# EAGLE design MOSFET_module_V3A (EAGLE 9.1.2)

## Sheet 1 of 2
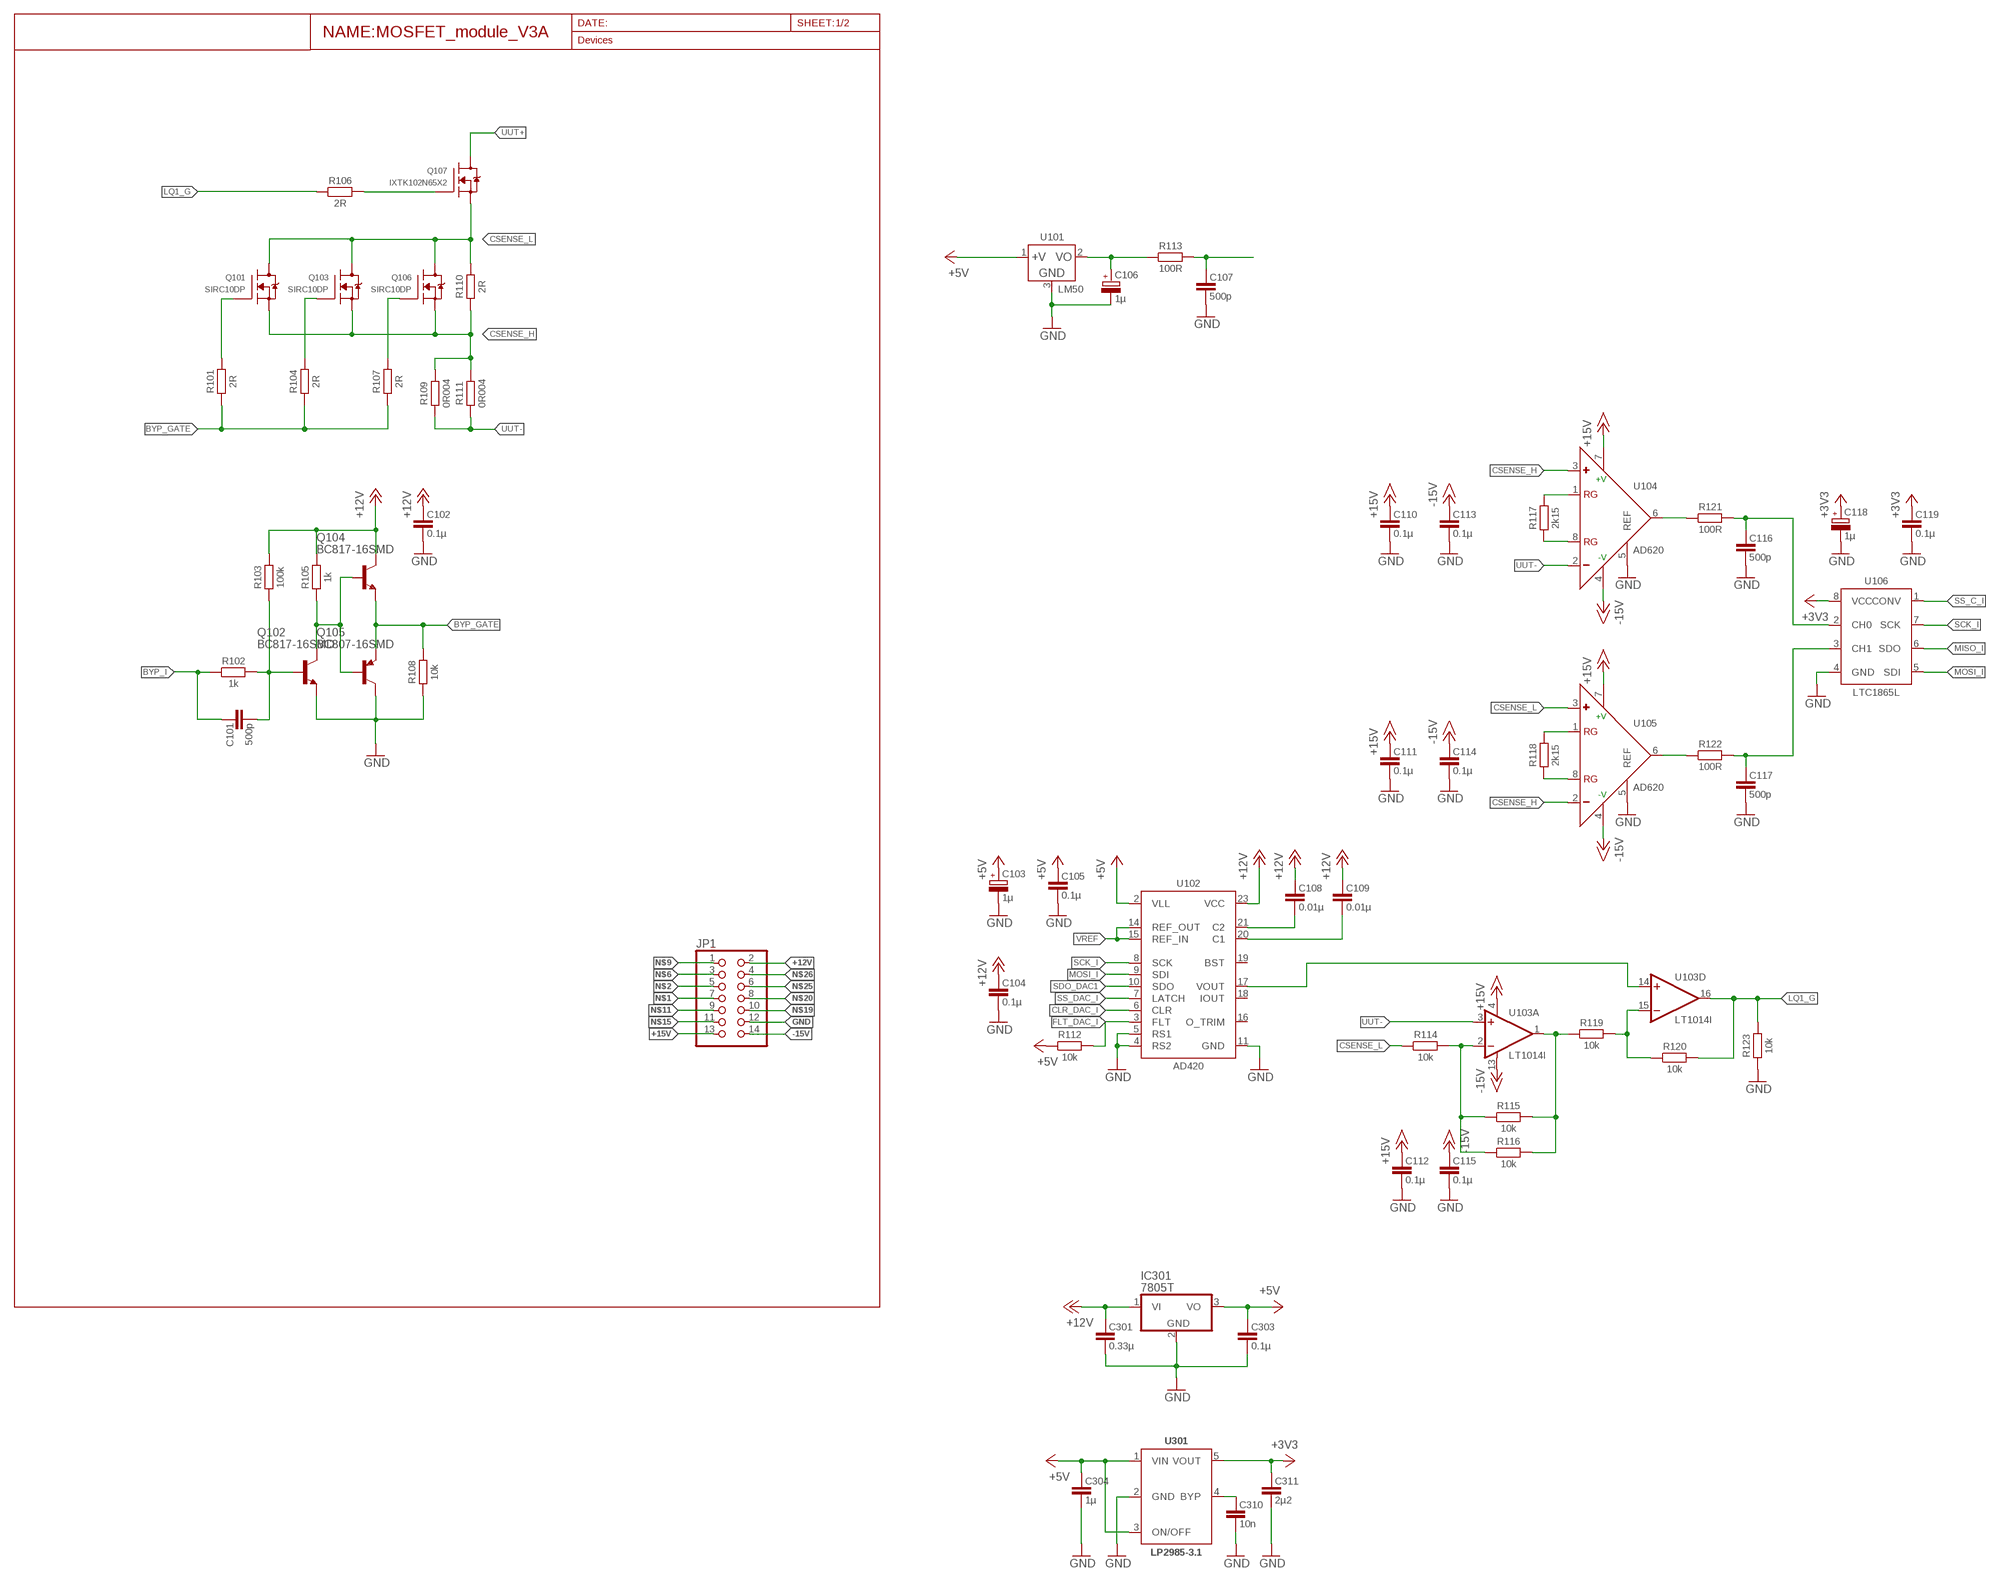
[diagram p0: schematic, sheet 1]

### Parts
C101  500p  C-EU-1608  [C1608]
C102  0.1µ  C-EU-3216  [C3216]
C103  1µ  CPOL-3216-A  [CT3216]
C104  0.1µ  C-EU-3216  [C3216]
C105  0.1µ  C-EU-3216  [C3216]
C106  1µ  CPOL-3216-A  [CT3216]
C107  500p  C-EU-1608  [C1608]
C108  0.01µ  C-EU-3216  [C3216]
C109  0.01µ  C-EU-3216  [C3216]
C110  0.1µ  C-EU-3216  [C3216]
C111  0.1µ  C-EU-3216  [C3216]
C112  0.1µ  C-EU-3216  [C3216]
C113  0.1µ  C-EU-3216  [C3216]
C114  0.1µ  C-EU-3216  [C3216]
C115  0.1µ  C-EU-3216  [C3216]
C116  500p  C-EU-1608  [C1608]
C117  500p  C-EU-1608  [C1608]
C118  1µ  CPOL-3216-A  [CT3216]
C119  0.1µ  C-EU-3216  [C3216]
C301  0.33µ  C-EU-3216  [C3216]
C303  0.1µ  C-EU-3216  [C3216]
C304  1µ  C-EU-3216  [C3216]
C310  10n  C-EU-3216  [C3216]
C311  2µ2  C-EU-3216  [C3216]
IC301  7805T  [TO220H]
JP1  PINHD-2X7  [2X07]
Q101  SIRC10DP  [POWERPAK-SO-8]
Q102  BC817-16SMD  [SOT23-BEC]
Q103  SIRC10DP  [POWERPAK-SO-8]
Q104  BC817-16SMD  [SOT23-BEC]
Q105  BC807-16SMD  [SOT23-BEC]
Q106  SIRC10DP  [POWERPAK-SO-8]
Q107  IXTK102N65X2  IXTK102N65X2-V  [TO-264P-V]
R101  2R  R-EU-3216  [R3216W]
R102  1k  R-EU-1608  [R1608]
R103  100k  R-EU-1608  [R1608]
R104  2R  R-EU-3216  [R3216W]
R105  1k  R-EU-1608  [R1608]
R106  2R  R-EU-3216  [R3216W]
R107  2R  R-EU-3216  [R3216W]
R108  10k  R-EU-1608  [R1608]
R109  0R004  R-EU-6332  [R6332W]
R110  2R  R-EU-3216  [R3216W]
R111  0R004  R-EU-6332  [R6332W]
R112  10k  R-EU-1608  [R1608]
R113  100R  R-EU-2012  [R2012W]
R114  10k  R-EU-1608  [R1608]
R115  10k  R-EU-1608  [R1608]
R116  10k  R-EU-1608  [R1608]
R117  2k15  R-EU-2012  [R2012W]
R118  2k15  R-EU-2012  [R2012W]
R119  10k  R-EU-1608  [R1608]
R120  10k  R-EU-1608  [R1608]
R121  100R  R-EU-2012  [R2012W]
R122  100R  R-EU-2012  [R2012W]
R123  10k  R-EU-1608  [R1608]
U101  LM50  [SOT23W]
U102  AD420  AD420RW-24  [SO24W]
U103  LT1014I  LT1014ISW  [SO16W]
U104  AD620  AD620R-8  [SO8]
U105  AD620  AD620R-8  [SO8]
U106  LTC1865L  [SO8]
U301  LP2985-3.1  [SOT23-5L]

### Nets
+3V3: C118.+ C119.1 C311.1 U106.8(VCC) U301.5(VOUT)
+5V: C103.+ C105.1 C303.1 C304.1 IC301.3(VO) R112.1 U101.1(+V) U102.2(VLL) U301.1(VIN) U301.3(ON/OFF) ; also sheet 2
+12V: C102.1 C104.1 C108.1 C109.1 C301.1 IC301.1(VI) JP1.2 Q104.C R103.2 R105.2 U102.23(VCC)
+15V: C110.1 C111.1 C112.1 JP1.13 U103.4(A:V+) U104.7(+V) U105.7(+V)
-15V: C113.1 C114.1 C115.1 JP1.14 U103.13(A:V-) U104.4(-V) U105.4(-V)
BYP_GATE: Q104.E Q105.E R101.1 R104.1 R107.1 R108.2
BYP_I: C101.1 R102.1
CLR_DAC_I: U102.6(CLR)
CSENSE_H: Q101.1(S) Q101.2(S) Q101.3(S) Q103.1(S) Q103.2(S) Q103.3(S) Q106.1(S) Q106.2(S) Q106.3(S) R109.2 R110.1 R111.2 U104.3(+) U105.2(-)
CSENSE_L: Q101.5(D) Q103.5(D) Q106.5(D) Q107.3(S) R110.2 R114.1 U105.3(+)
DAC_VOUT: U102.17(VOUT) U103.14(D:+IN)
FLT_DAC_I: R112.2 U102.3(FLT)
GATE1: Q107.1(G) R106.2
GND: C102.2 C103.- C104.2 C105.2 C106.- C107.2 C110.2 C111.2 C112.2 C113.2 C114.2 C115.2 C116.2 C117.2 C118.- C119.2 C301.2 C303.2 C304.2 C310.2 C311.2 IC301.2(GND) JP1.12 Q102.E Q105.C R108.1 R123.1 U101.3(GND) U102.4(RS2) U102.5(RS1) U102.11(GND) U104.5(REF) U105.5(REF) U106.4(GND) U301.2(GND) ; also sheet 2
LBQ11_G: Q101.4(G) R101.2
LBQ12_G: Q103.4(G) R104.2
LBQ13_G: Q106.4(G) R107.2
LQ1_G: R106.1 R120.2 R123.2 U103.16(D:OUT)
MISO_I: U106.6(SDO)
MOSI_I: U102.9(SDI) U106.5(SDI)
N$1: JP1.7
N$2: JP1.5
N$3: C108.2 U102.21(C2)
N$4: C109.2 U102.20(C1)
N$5: Q102.C Q104.B Q105.B R105.1
N$6: JP1.3
N$7: C107.1 R113.2
N$8: C101.2 Q102.B R102.2 R103.1
N$9: JP1.1
N$10: C310.1 U301.4(BYP)
N$11: JP1.9
N$12: R119.2 R120.1 U103.15(D:-IN)
N$13: R115.2 R116.2 R119.1 U103.1(A:OUT)
N$14: R114.2 R115.1 R116.1 U103.2(A:-IN)
N$15: JP1.11
N$19: JP1.10
N$20: JP1.8
N$21: C116.1 R121.2 U106.2(CH0)
N$22: C117.1 R122.2 U106.3(CH1)
N$23: R122.1 U105.6(OUT)
N$24: R121.1 U104.6(OUT)
N$25: JP1.6
N$26: JP1.4
RG1_L3: R117.2 U104.1(RG)
RG1_L4: R118.2 U105.1(RG)
RG2_L3: R117.1 U104.8(RG)
RG2_L4: R118.1 U105.8(RG)
SCK_I: U102.8(SCK) U106.7(SCK)
SDO_DAC1: U102.10(SDO)
SS_C_I: U106.1(CONV)
SS_DAC_I: U102.7(LATCH)
T1_OUT: C106.+ R113.1 U101.2(VO)
UUT+ [500V]: Q107.2(D)
UUT-: R109.1 R111.1 U103.3(A:+IN) U104.2(-)
VREF: U102.14(REF_OUT) U102.15(REF_IN)
Unconnected: U102.16(O_TRIM) U102.18(IOUT) U102.19(BST) U103.5(B:+IN) U103.6(B:-IN) U103.7(B:OUT) U103.10(C:OUT) U103.11(C:-IN) U103.12(C:+IN)

## Sheet 2 of 2
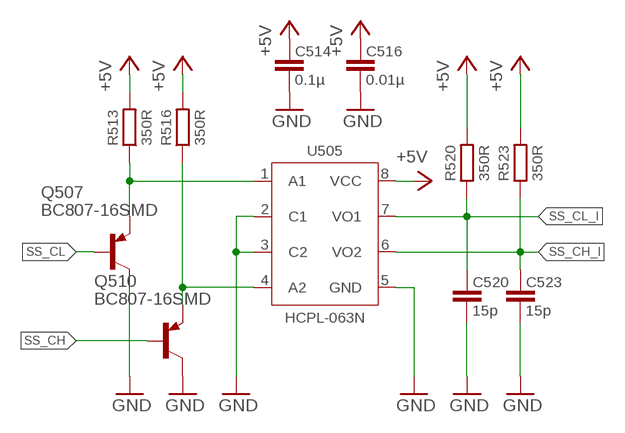
[diagram p1: schematic, sheet 2]

### Parts
C514  0.1µ  C-EU-3216  [C3216]
C516  0.01µ  C-EU-3216  [C3216]
C520  15p  C-EU-1608  [C1608]
C523  15p  C-EU-1608  [C1608]
Q507  BC807-16SMD  [SOT23-BEC]
Q510  BC807-16SMD  [SOT23-BEC]
R513  350R  R-EU-1608  [R1608]
R516  350R  R-EU-1608  [R1608]
R520  350R  R-EU-1608  [R1608]
R523  350R  R-EU-1608  [R1608]
U505  HCPL-063N  [SO8]

### Nets
+5V: C514.1 C516.1 R513.2 R516.2 R520.2 R523.2 U505.8(VCC) ; also sheet 1
GND: C514.2 C516.2 C520.2 C523.2 Q507.C Q510.C U505.2(C1) U505.3(C2) U505.5(GND) ; also sheet 1
N$49: Q507.E R513.1 U505.1(A1)
N$63: Q510.E R516.1 U505.4(A2)
SS_CH: Q510.B
SS_CH_I: C523.1 R523.1 U505.6(VO2)
SS_CL: Q507.B
SS_CL_I: C520.1 R520.1 U505.7(VO1)

## Library data of the parts
C101 C102 C104 C105 C107-C117 C119 C301 C303 C304 C310 C311 C514 C516 C520 C523 = passives:C-EU
C103 C106 C118 = passives:CPOL
IC301 = linear:78*: Positive VOLTAGE REGULATOR Source: http://cache.national.com/ds/LM/LM78L05.pdf http://www.fairchildsemi.com/ds/LM/LM7805.pdf
JP1 = pinhead:PINHD-2X7: PIN HEADER
Q101 Q103 Q106 = transistors:SIRC10DP
Q102 Q104 = transistor-npn:BC817*: NPN Transistor
Q105 Q507 Q510 = transistor-pnp:BC807*: PNP Transistror
Q107 = transistors:IXTK102N65X2
R101-R123 R513 R516 R520 R523 = passives:R-EU
U101 = ic:LM50
U102 = ic:AD420: The AD420 is a complete digital to current loop output converter, designed to meet the needs of the industrial control market. It provides a high precision, fully integrated, low cost single-chip solution for generating current loop signals in a compact 24-lead SOIC or PDIP package. The output current range can be programmed to 4 mA to 20 mA, 0 mA to 20 mA or to an overrange function of 0 mA to 24 mA. The AD420 can alternatively provide a voltage output from a separate pin that can be configured to provide 0 V to 5 V, 0 V to 10 V, ±5 V, or ±10 V with the addition of a single external buffer amplifier.
U103 = ic:LT1014: The LT ®1014 is the first precision quad operational amplifier which directly upgrades designs in the industry standard 14-pin DIP LM324/LM348/OP-11/4156 pin configuration. It is no longer necessary to compromise specifications, while saving board space and cost, as compared to single operational amplifiers. The LT1014’s low offset voltage of 50µV, drift of 0.3µV/°C, offset current of 0.15nA, gain of 8 million, common mode rejection of 117dB and power supply rejection of 120dB qualify it as four truly precision operational amplifiers. Particularly important is the low offset voltage, since no offset null terminals are provided in the quad configuration. Although supply current is only 350µA per amplifier, a new output stage design sources and sinks in excess of 20mA of load current, while retaining high voltage gain.
U104 U105 = ic:AD620
U106 = ic:LTC1865L: The LTC®1864L/LTC1865L are 16-bit A/D converters that are offered in MSOP and SO-8 packages and operate on a single 3V supply. At 150ksps, the supply current is only 450µA. The supply current drops at lower speeds because the LTC1864L/LTC1865L automatically power down between conversions. These 16-bit switched capacitor successive approximation ADCs include sample-and-holds. The LTC1864L has a differential analog input with an external reference pin. The LTC1865L offers a softwareselectable 2-channel MUX and an external reference pin on the MSOP version. The 3-wire, serial I/O, small MSOP or SO-8 package and extremely high sample rate-to-power ratio make these ADCs ideal choices for compact, low power, high speed systems
U301 = ic:LP2985
U505 = ic:HCPL-063N

## Net classes
0 default: width 0.203 mm, drill 0.3 mm, clearance 0.203 mm
1 500V: width 0.203 mm, drill 0.305 mm, clearance 2.6 mm

## Board
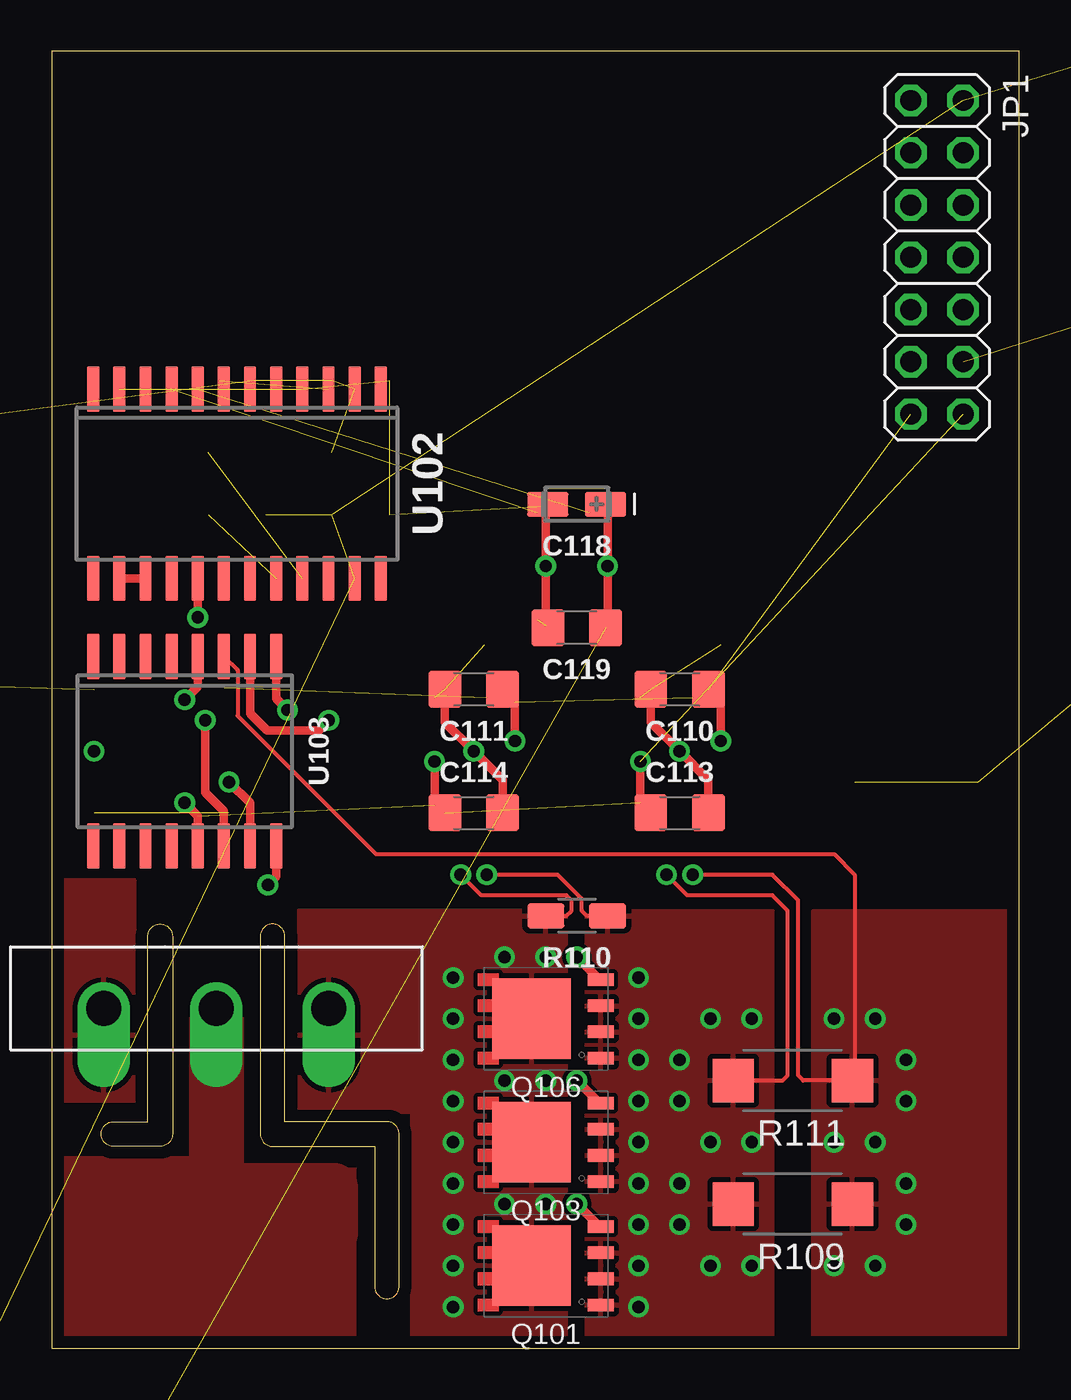
[diagram p2: board, top side]
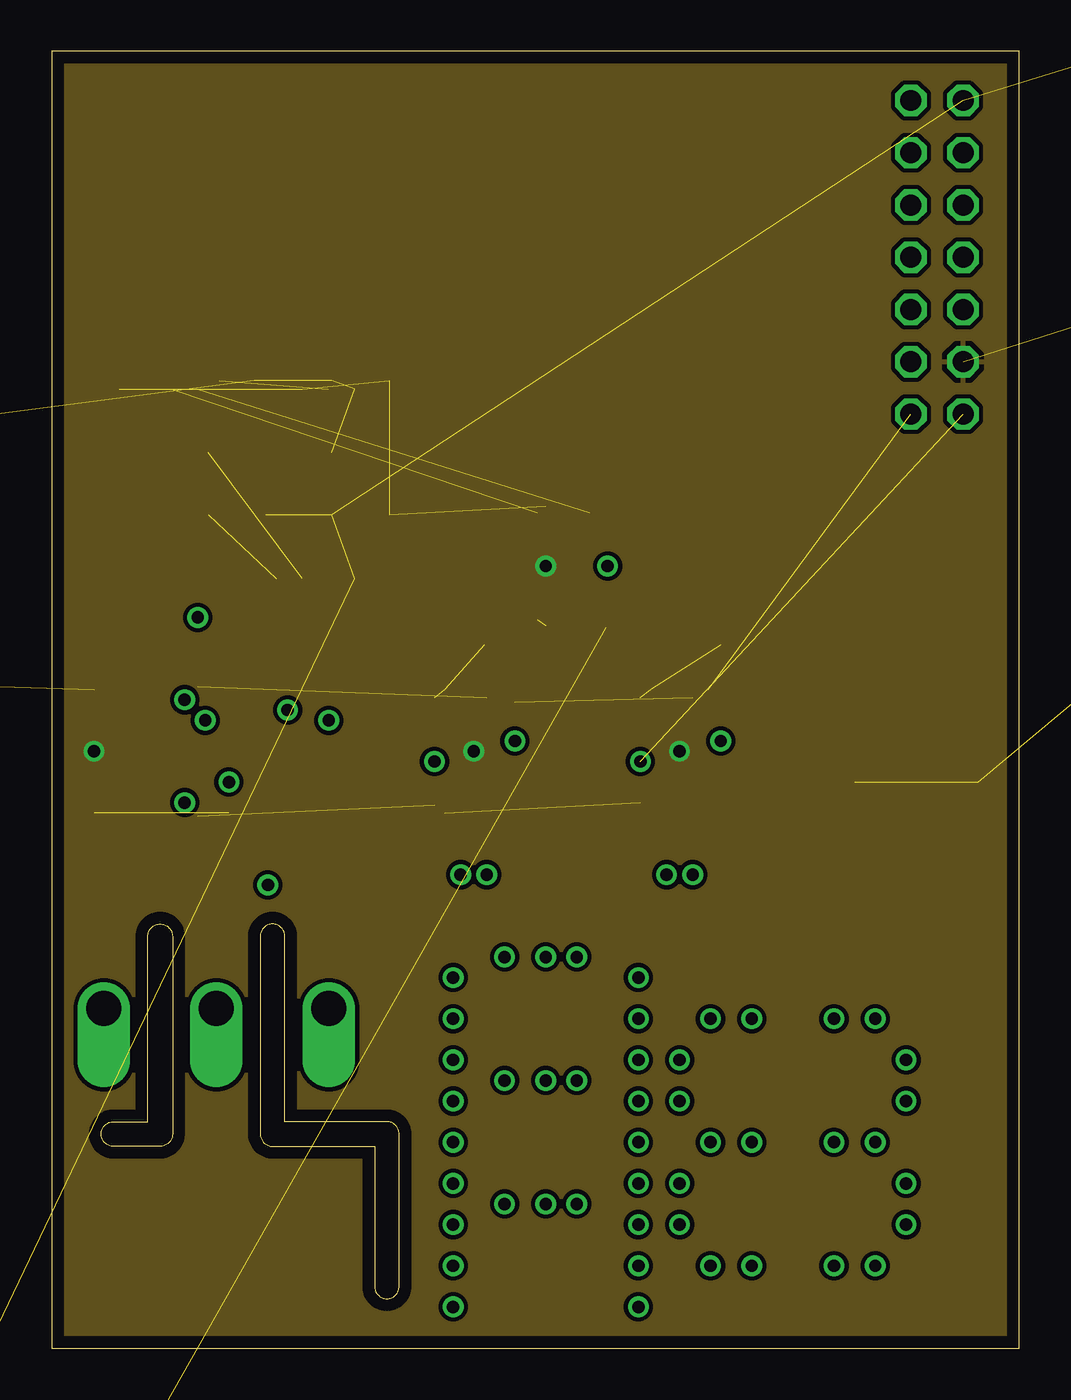
[diagram p3: board, inner layer Route2]
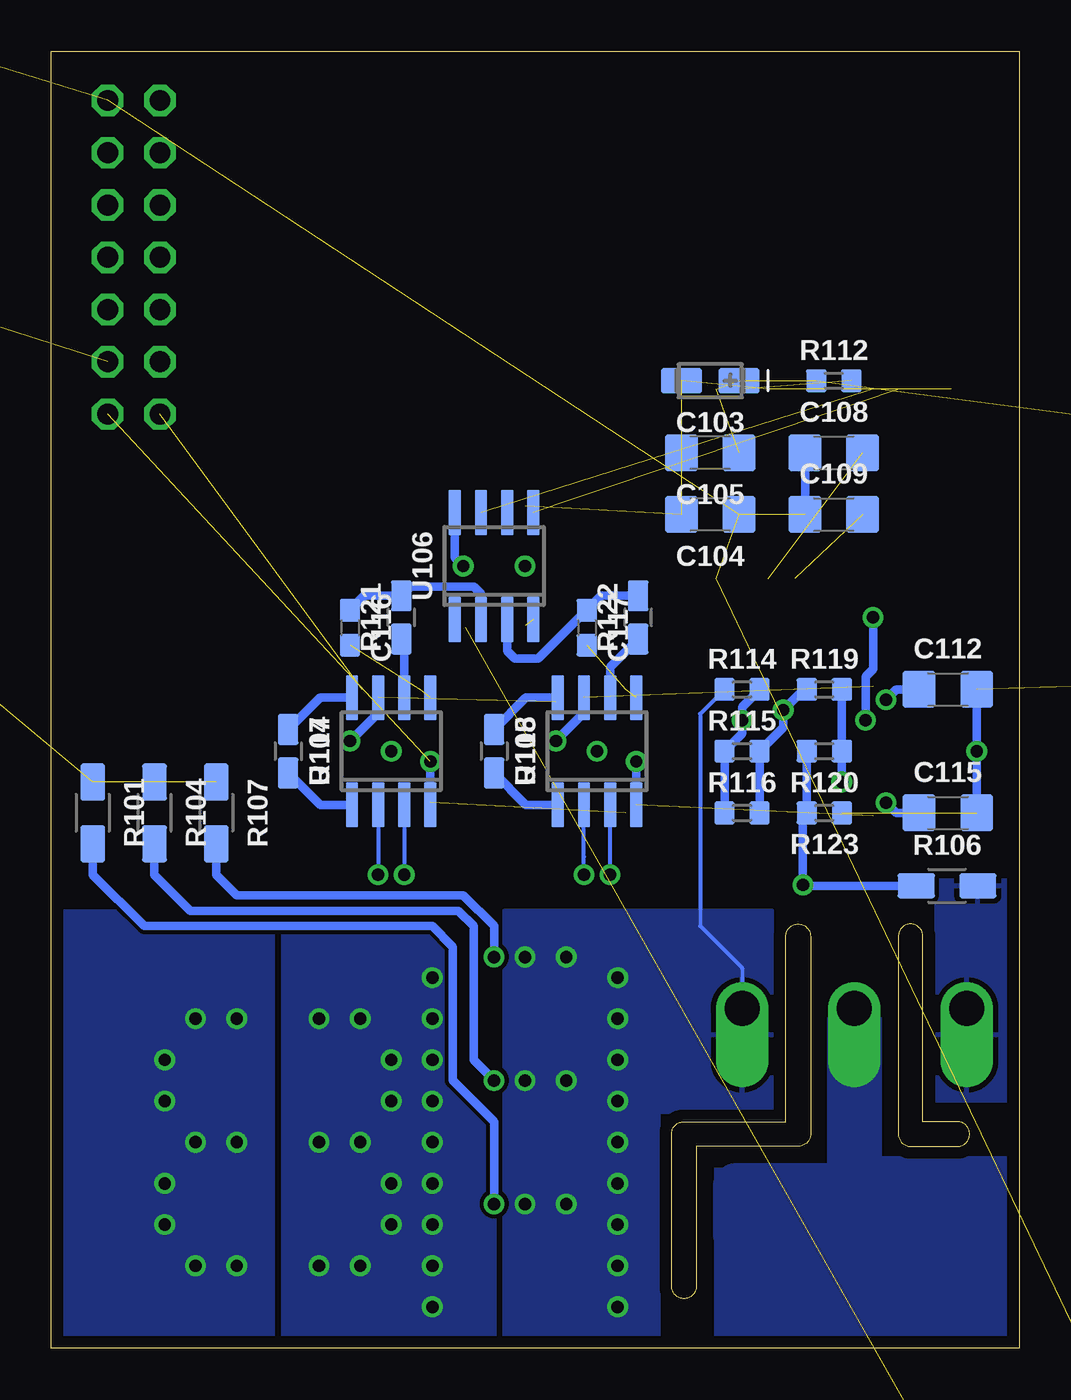
[diagram p4: board, bottom side, seen from below]

Size 47 x 63 mm. Coordinates in mm from the lower left corner, seen from the top.
Outline: 0,0 13,0 47,0 47,63 0,63 0,11 0,0
Outline: 3,11 4.67,11 4.67,20 arc-180 5.87,20 5.87,10.4 arc-90 5.27,9.8 3,9.8 arc-180 3,11
Outline: 13,11 11.33,11 11.33,20 arc180 10.13,20 10.13,10.4 arc90 10.73,9.8 13,9.8 15.68,9.8 15.68,3 arc180 16.88,3 16.88,10.4 arc90 16.28,11 13,11
Copper layers (1+2*15+16): Top 0.035mm / dielectric 0.18mm / Route2 0.017mm / dielectric 1.12mm / Route15 0.017mm / dielectric 0.18mm / Bottom 0.035mm
Design rules "JLCPCB 4 layers 1oz *": minimum track width 6mil, minimum drill 0.35mm, track to track 6mil, track to pad 6mil, pad to pad 6mil, via to via 6mil, smd to smd 6mil, copper to edge 0.6mm, drill to drill 6mil, minimum pad ring 10mil, minimum via ring 8mil, stop-mask expansion 4mil, vias tented up to drill 0mil, thermal gap 10mil

### Footprints (pad centres in the part's own frame; a part is rotated, then mirrored left to right if it is on the bottom)
C1608 = smd 1.1 x 1: 1 -0.85,0; 2 0.85,0
C3216 = smd 1.6 x 1.8: 1 -1.4,0; 2 1.4,0
CT3216 = smd 2 x 1.2: + -1.4,0; - 1.4,0
TO220H = drill 1.118 long: 1 -2.54,-10.16; 2 0,-10.16; 3 2.54,-10.16 | hole 3.302: 0,4.826
2X07 = drill 1.016 octagon: 1 -7.62,-1.27; 2 -7.62,1.27; 3 -5.08,-1.27; 4 -5.08,1.27; 5 -2.54,-1.27; 6 -2.54,1.27; 7 0,-1.27; 8 0,1.27; 9 2.54,-1.27; 10 2.54,1.27; 11 5.08,-1.27; 12 5.08,1.27; 13 7.62,-1.27; 14 7.62,1.27
POWERPAK-SO-8 = smd 1.27 x 0.61: 1 -2.67,1.905; 2 -2.67,0.635; 3 -2.67,-0.635; 4 -2.67,-1.905 | smd 3.81 x 3.91: 5 0.69,0
SOT23-BEC = smd 1 x 1.4: B -0.95,-1.1; C 0,1.1; E 0.95,-1.1
TO-264P-V = drill 1.7 pad 2.4 offset: 1 -5.46,0; 2 0,0; 3 5.46,0
R3216W = smd 1.8 x 1.2: 1 -1.499,0; 2 1.499,0
R1608 = smd 1 x 1.1: 1 -0.85,0; 2 0.85,0
R6332W = smd 2 x 2.1: 1 -2.896,0; 2 2.896,0
R2012W = smd 1.5 x 1: 1 -1.052,0; 2 1.052,0
SOT23W = smd 1 x 1.4: 1 -0.95,-1.303; 2 0.95,-1.303; 3 0,1.303
SO24W = smd 0.6 x 2.2: 1 -6.985,-4.6; 2 -5.715,-4.6; 3 -4.445,-4.6; 4 -3.175,-4.6; 5 -1.905,-4.6; 6 -0.635,-4.6; 7 0.635,-4.6; 8 1.905,-4.6; 9 3.175,-4.6; 10 4.445,-4.6; 11 5.715,-4.6; 12 6.985,-4.6; 13 6.985,4.6; 14 5.715,4.6; 15 4.445,4.6; 16 3.175,4.6; 17 1.905,4.6; 18 0.635,4.6; 19 -0.635,4.6; 20 -1.905,4.6; 21 -3.175,4.6; 22 -4.445,4.6; 23 -5.715,4.6; 24 -6.985,4.6
SO16W = smd 0.6 x 2.2: 1 -4.445,-4.6; 2 -3.175,-4.6; 3 -1.905,-4.6; 4 -0.635,-4.6; 5 0.635,-4.6; 6 1.905,-4.6; 7 3.175,-4.6; 8 4.445,-4.6; 9 4.445,4.6; 10 3.175,4.6; 11 1.905,4.6; 12 0.635,4.6; 13 -0.635,4.6; 14 -1.905,4.6; 15 -3.175,4.6; 16 -4.445,4.6
SO8 = smd 0.6 x 2.2: 1 -1.905,-2.6; 2 -0.635,-2.6; 3 0.635,-2.6; 4 1.905,-2.6; 5 1.905,2.6; 6 0.635,2.6; 7 -0.635,2.6; 8 -1.905,2.6
SOT23-5L = smd 0.55 x 1.2: 1 -0.95,-1.3; 2 0,-1.3; 3 0.95,-1.3; 4 0.95,1.3; 5 -0.95,1.3

### Placement (x,y rotation side)
C101  76,65 0 top  (outside the outline)
C102  76,70 0 top  (outside the outline)
C103  15,47 180 bottom
C104  15,40.5 180 bottom
C105  15,43.5 180 bottom
C106  -31,33 0 top  (outside the outline)
C107  -31,28 0 top  (outside the outline)
C108  9,43.5 0 bottom
C109  9,40.5 0 bottom
C110  30.5,32 180 top
C111  20.5,32 180 top
C112  3.46,32 0 bottom
C113  30.5,26 0 top
C114  20.5,26 0 top
C115  3.46,26 0 bottom
C116  32.5,35 270 bottom
C117  21,35 270 bottom
C118  25.5,41 180 top
C119  25.5,35 180 top
C301  -42,-79 0 top  (outside the outline)
C303  -37,-79 0 top  (outside the outline)
C304  -42,-93 0 top  (outside the outline)
C310  -37,-93 0 top  (outside the outline)
C311  -42,-99 0 top  (outside the outline)
C514  -28,-39 0 top  (outside the outline)
C516  -42,-47 0 top  (outside the outline)
C520  -38,-53 0 top  (outside the outline)
C523  -34,-53 0 top  (outside the outline)
IC301  -36,-64 0 top  (outside the outline)
JP1  43,53 270 top
Q101  24,4 180 top
Q102  76,76 90 top  (outside the outline)
Q103  24,10 180 top
Q104  83,81 90 top  (outside the outline)
Q105  83,76 90 top  (outside the outline)
Q106  24,16 180 top
Q107  8,16.5 0 top
Q507  -42,-32 0 top  (outside the outline)
Q510  -42,-40 0 top  (outside the outline)
R101  45,26 270 bottom
R102  76,60 0 top  (outside the outline)
R103  83,70 0 top  (outside the outline)
R104  42,26 270 bottom
R105  83,65 0 top  (outside the outline)
R106  3.5,22.46 0 bottom
R107  39,26 270 bottom
R108  83,60 0 top  (outside the outline)
R109  36,7 180 top
R110  25.5,21 180 top
R111  36,13 180 top
R112  9,47 0 bottom
R113  -31,37 0 top  (outside the outline)
R114  13.46,32 0 bottom
R115  13.46,29 0 bottom
R116  13.46,26 0 bottom
R117  35.5,29 270 bottom
R118  25.5,29 270 bottom
R119  9.46,32 0 bottom
R120  9.46,29 180 bottom
R121  30,35.5 90 bottom
R122  18.5,35.5 90 bottom
R123  9.46,26 180 bottom
R513  -37,-47 0 top  (outside the outline)
R516  -32,-47 0 top  (outside the outline)
R520  -27,-47 0 top  (outside the outline)
R523  -42,-53 0 top  (outside the outline)
U101  -30,43 0 top  (outside the outline)
U102  9,42 180 top
U103  6.46,29 180 top
U104  30.5,29 0 bottom
U105  20.5,29 0 bottom
U106  25.5,38 0 bottom
U301  -40,-86 0 top  (outside the outline)
U505  -40,-24 0 top  (outside the outline)

### Tracks (layer width: path | path; a pad name or v marks a point on that pad's centre or on a via)
+3V3  (via drill 0.6)  (2 unrouted)
  Top 0.406: C119.1 27,35.1 v27,38 27,40.9 C118.+
  Bottom 0.406: U106.8 27.41,38.41 v27,38
+5V  (16 unrouted)
+12V  (9 unrouted)
  Bottom 0.406: C108.1 C109.1
+15V  (via drill 0.6)  (3 unrouted)
  Top 0.406: v6.46,31.5 7.09,32.13 U103.4 | C111.1 22.5,31.4 v22.5,29.5 | C110.1 32.5,31.4 v32.5,29.5
  Bottom 0.406: C112.1 5.96,32 v6.46,31.5 | v22.5,29.5 21.14,30.86 U105.7 | U104.7 31.14,30.86 v32.5,29.5
-15V  (via drill 0.6)  (3 unrouted)
  Top 0.406: v6.46,26.5 7.09,25.86 U103.13 | C114.1 18.59,26.5 v18.59,28.5 | C113.1 28.59,26.5 v28.59,28.5
  Bottom 0.406: C115.1 5.96,26 v6.46,26.5 | v18.59,28.5 U105.4 | U104.4 v28.59,28.5
BYP_GATE  (5 unrouted)
BYP_I  (1 unrouted)
CSENSE_H  (via drill 0.6)
  Top 0.203: R110.1 26,21 25.75,21.25 25.75,21.82 24.57,23 v21.14,23 | R111.2 35.5,13 35.75,13.25 35.75,21.25 35,22 30.86,22 v29.86,23
  Bottom 0.203: v21.14,23 21.14,23.86 U105.2 | U104.3 v29.86,23
  other vias: 34,10 32,10 32,4 34,4 34,16 32,16 28.5,10 28.5,12 28.5,14 28.5,16 28.5,18 28.5,8 28.5,6 28.5,4 28.5,2 30.5,6 30.5,8 30.5,12 30.5,14
  pour Top: 26,-2 26,21.25 35,21.25 35,-2
  pour Bottom: 35.75,-2 35.75,21.25 25.5,21.25 25.5,-2
CSENSE_L  (via drill 0.6)
  Top 0.203: R110.2 25,21 25.25,21.25 25.25,21.75 25,22 20.86,22 v19.86,23
  Bottom 0.203: v19.86,23 19.86,23.14 U105.3 | R114.1 15.5,30.81 15.5,20.5 13.46,18.46 Q107.3
  other vias: 19.5,2 19.5,4 19.5,6 19.5,8 19.5,10 19.5,12 19.5,14 19.5,16 19.5,18 22,7 24,7 22,13 24,13 22,19 24,19
  pour Top: 17.5,-2 25,-2 25,21.25 12,21.25 12,11.5 17.5,11.45
  pour Bottom: 12,21.25 25,21.25 25,-2 17.5,-2 17.5,11.45 12,11.5
DAC_VOUT  (via drill 0.6)
  Top 0.406: 8.37,26.09 U103.14 8.37,26.09 | 8.37,26.09 7.46,27 v7.46,30.5 | U102.17 v7.09,35.5
  Bottom 0.406: v7.09,35.5 7.09,33 7.46,32.63 v7.46,30.5
FLT_DAC_I  (1 unrouted)
GATE1
  pour Bottom (rank 4): -3,12 4,12 4,22.75 -3,22.75
  pour Top (rank 3): 4,12 -4,12 -4,22.75 4,22.75
GND  (via drill 0.6)  (35 unrouted)
  Top 0.406: C111.2 19.1,30.4 v20.5,29 21.9,27.6 C114.2 | C110.2 29.1,30.4 v30.5,29 31.9,27.6 C113.2 | C119.2 24,35.1 v24,38 24,40.9 | 24,40.9 C118.- 24,40.9
  Bottom 0.406: C115.2 2.06,28.6 v2.06,29 2.06,29.4 C112.2
  pour Route2 (rank 3): -3,66 53,66 53,-3 -3,-3
LBQ11_G  (via drill 0.6)
  Top 0.406: Q101.4 26.59,5.91 v25.5,7
  Bottom 0.406: v25.5,7 25.5,11 27.5,13 27.5,19.5 28.5,20.5 42.5,20.5 45,23 R101.2
LBQ12_G  (via drill 0.6)
  Top 0.406: Q103.4 26.59,11.9 v25.5,13
  Bottom 0.406: v25.5,13 26.5,14 26.5,20.5 27.25,21.25 40.25,21.25 42,23 R104.2
LBQ13_G  (via drill 0.6)
  Top 0.406: Q106.4 26.59,17.91 v25.5,19
  Bottom 0.406: v25.5,19 25.5,20.5 27,22 38,22 39,23 R107.2
LQ1_G  (via drill 0.6)
  Top 0.406: U103.16 10.9,22.91 v10.5,22.5
  Bottom 0.406: R120.2 R123.2 10.5,25.81 v10.5,22.5 10.46,22.46 R106.1
MOSI_I  (1 unrouted)
N$3  (1 unrouted)
N$4  (1 unrouted)
N$5  (3 unrouted)
N$7  (1 unrouted)
N$8  (3 unrouted)
N$10  (1 unrouted)
N$12  (via drill 0.6)
  Top 0.406: U103.15 9.63,26.48 v8.61,27.5
  Bottom 0.406: R119.2 R120.1 8.61,27.85 v8.61,27.5
N$13  (via drill 0.6)
  Top 0.406: U103.1 10.9,31.55 v11.46,31
  Bottom 0.406: R119.1 10.46,32 v11.46,31 11.46,30.15 R115.2 R116.2
N$14  (via drill 0.6)
  Top 0.406: U103.2 9.63,30.82 10.46,30 12.96,30 v13.46,30.5
  Bottom 0.406: R114.2 13.46,31.15 v13.46,30.5 13.46,29.85 R115.1 R116.1
N$21
  Bottom 0.406: U106.2 26.14,36.63 26.5,37 29.55,37 R121.2 31.8,36.55 C116.1
N$22
  Bottom 0.406: R122.2 20.3,36.55 C117.1 23.35,33.5 24.5,33.5 24.86,33.87 U106.3
N$23
  Bottom 0.406: R122.1 19.86,33.08 U105.6
N$24
  Bottom 0.406: R121.1 29.86,34.31 U104.6
N$49  (2 unrouted)
N$63  (2 unrouted)
RG1_L3
  Bottom 0.406: U104.1 33.95,26.4 R117.2
RG1_L4
  Bottom 0.406: R118.2 23.95,26.4 U105.1
RG2_L3
  Bottom 0.406: R117.1 33.95,31.6 U104.8
RG2_L4
  Bottom 0.406: R118.1 23.95,31.6 U105.8
SCK_I  (1 unrouted)
SS_CH_I  (2 unrouted)
SS_CL_I  (2 unrouted)
T1_OUT  (2 unrouted)
UUT+
  pour Top (rank 4, no thermals): -2,16 16.5,16 16.5,-2 -2,-2
  pour Bottom (rank 5, no thermals): 16,16 -2.5,16 -2.5,-3 16,-3
UUT-  (via drill 0.6)
  Top 0.203: U103.3 9.03,32.94 9.03,30.71 15.74,24 38,24 39,23 39,13.1 R111.1 36.5,13 36.25,13.25 36.25,21.75 35,23 v31.14,23
  Bottom 0.203: U104.2 v31.14,23
  other vias: 38,4 40,4 41.5,6 41.5,8 40,10 38,10 41.5,12 41.5,14 40,16 38,16
  pour Top: 37,21.25 52,21.25 52,-2 37,-2
  pour Bottom: 52,21.25 36.25,21.25 36.25,-2 52,-2
VREF
  Top 0.406: U102.14 U102.15